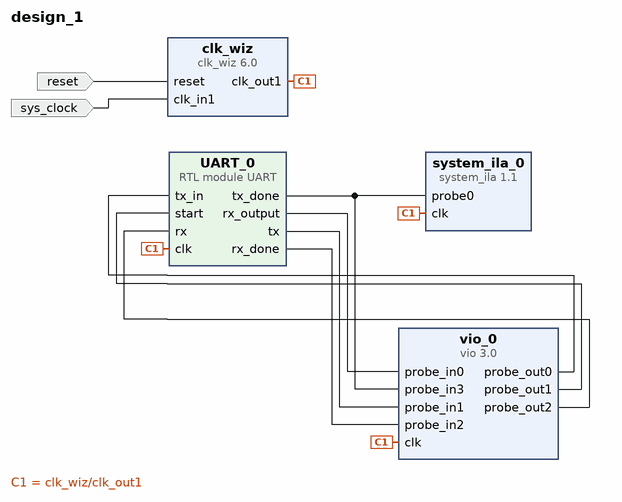
[diagram p0: block diagram of the top level]
# Vivado block design design_1, xc7a100tcsg324-1, Vivado 2018.2
create_bd_design design_1

create_bd_port -dir I -type rst reset
set_property -dict {CONFIG.POLARITY ACTIVE_LOW} [get_bd_ports reset]
create_bd_port -dir I -type clk sys_clock
set_property -dict {CONFIG.FREQ_HZ 100000000 CONFIG.PHASE 0.000} [get_bd_ports sys_clock]

create_bd_cell -type module -reference UART UART_0
create_bd_cell -type ip -vlnv xilinx.com:ip:vio:3.0 vio_0
set_property -dict [list \
  CONFIG.C_PROBE_OUT0_WIDTH 8 \
  CONFIG.C_PROBE_IN0_WIDTH 8 \
  CONFIG.C_NUM_PROBE_OUT 3 \
  CONFIG.C_NUM_PROBE_IN 4 \
] [get_bd_cells vio_0]
create_bd_cell -type ip -vlnv xilinx.com:ip:clk_wiz:6.0 clk_wiz
set_property -dict [list \
  CONFIG.USE_BOARD_FLOW true \
  CONFIG.CLK_IN1_BOARD_INTERFACE sys_clock \
  CONFIG.RESET_BOARD_INTERFACE reset \
] [get_bd_cells clk_wiz]
create_bd_cell -type ip -vlnv xilinx.com:ip:system_ila:1.1 system_ila_0
set_property -dict {CONFIG.C_PROBE0_TYPE 0 CONFIG.C_NUM_OF_PROBES 1 CONFIG.C_MON_TYPE NATIVE} [get_bd_cells system_ila_0]

# ---- connections ----

connect_bd_net [get_bd_pins clk_wiz/clk_out1] [get_bd_pins UART_0/clk] [get_bd_pins vio_0/clk] [get_bd_pins system_ila_0/clk]
connect_bd_net [get_bd_pins vio_0/probe_out0] [get_bd_pins UART_0/tx_in]
connect_bd_net [get_bd_pins vio_0/probe_out1] [get_bd_pins UART_0/start]
connect_bd_net [get_bd_pins vio_0/probe_out2] [get_bd_pins UART_0/rx]
connect_bd_net [get_bd_pins UART_0/rx_output] [get_bd_pins vio_0/probe_in0]
connect_bd_net [get_bd_pins UART_0/tx] [get_bd_pins vio_0/probe_in1]
connect_bd_net [get_bd_pins UART_0/rx_done] [get_bd_pins vio_0/probe_in2]
connect_bd_net [get_bd_pins UART_0/tx_done] [get_bd_pins vio_0/probe_in3] [get_bd_pins system_ila_0/probe0]
connect_bd_net [get_bd_ports reset] [get_bd_pins clk_wiz/reset]
connect_bd_net [get_bd_ports sys_clock] [get_bd_pins clk_wiz/clk_in1]

validate_bd_design
save_bd_design
